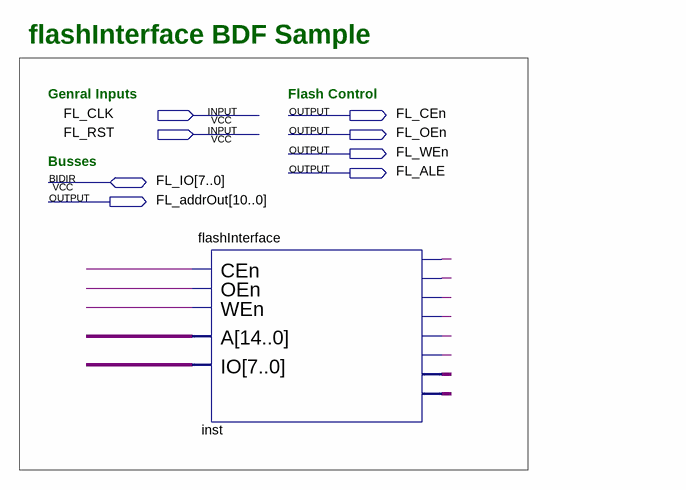
[diagram p0: schematic sheet]
// Quartus schematic flashInterfaceBDF.bdf as structural Verilog: 1 symbols, 8 pins
module flashInterfaceBDF (
  input  FL_CLK,
  input  FL_RST,
  inout  [7:0] FL_IO,
  output FL_CEn,
  output FL_OEn,
  output FL_WEn,
  output FL_ALE,
  output [10:0] FL_addrOut
);

  wire undriven_2, undriven_3, undriven_4;
  wire [7:0] inst_io;
  wire [14:0] undriven;

  flashInterface inst (
    .A(undriven), .WEn(undriven_2), .OEn(undriven_3), .CEn(undriven_4), .CLK(FL_CLK), .RST(FL_RST),
    .IO(inst_io), .FL_CEn(FL_CEn), .FL_OEn(FL_OEn), .FL_WEn(FL_WEn), .FL_AddrOut(FL_addrOut),
    .FL_ALE(FL_ALE), .FL_IO(FL_IO));

  // Notes on the sheet:
  //   flashInterface BDF Sample
  //   Genral Inputs
  //   Flash Control
  //   Busses
endmodule
